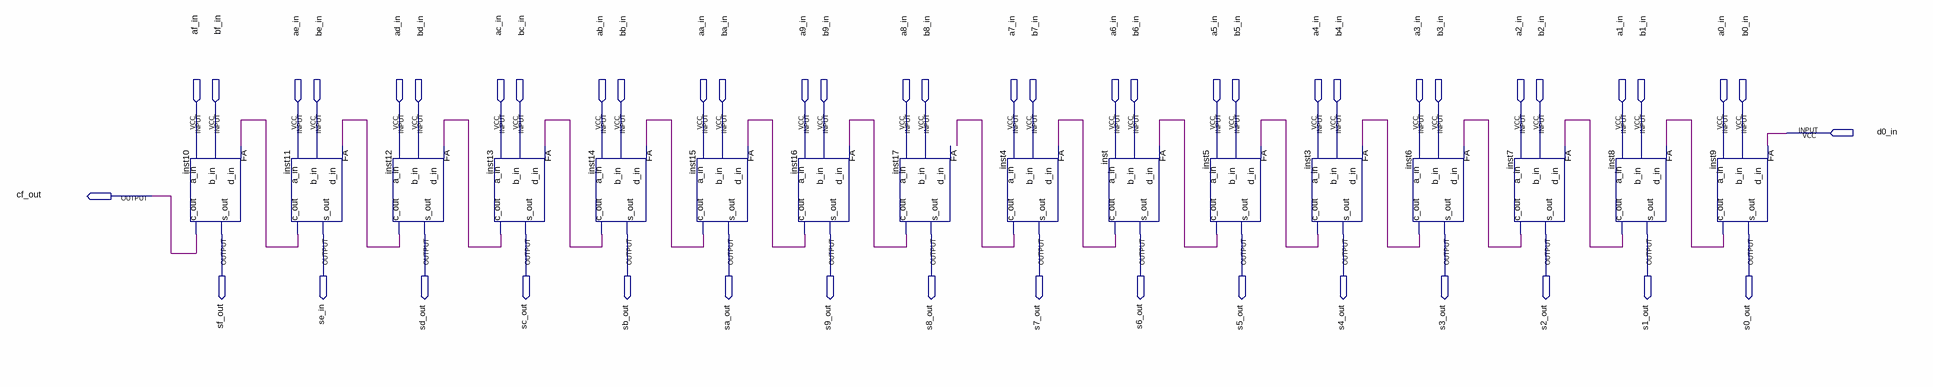
[diagram p0: schematic sheet]
// Quartus schematic sixteenBitFA.bdf as structural Verilog: 16 symbols, 50 pins
module sixteenBitFA (
  input  d0_in,
  input  af_in,
  input  bf_in,
  input  ae_in,
  input  be_in,
  input  ad_in,
  input  bd_in,
  input  ac_in,
  input  bc_in,
  input  ab_in,
  input  bb_in,
  input  aa_in,
  input  ba_in,
  input  a9_in,
  input  b9_in,
  input  a8_in,
  input  b8_in,
  input  a7_in,
  input  b7_in,
  input  a6_in,
  input  b6_in,
  input  a5_in,
  input  b5_in,
  input  a4_in,
  input  b4_in,
  input  a3_in,
  input  b3_in,
  input  a2_in,
  input  b2_in,
  input  a1_in,
  input  b1_in,
  input  a0_in,
  input  b0_in,
  output cf_out,
  output sf_out,
  output se_in,
  output sd_out,
  output sc_out,
  output sb_out,
  output sa_out,
  output s9_out,
  output s8_out,
  output s7_out,
  output s6_out,
  output s5_out,
  output s4_out,
  output s3_out,
  output s2_out,
  output s1_out,
  output s0_out
);

  wire inst3_c_out, inst4_c_out, inst5_c_out, inst6_c_out, inst7_c_out, inst8_c_out, inst9_c_out,
       inst11_c_out, inst12_c_out, inst13_c_out, inst14_c_out, inst15_c_out, inst16_c_out, inst17_c_out,
       inst_c_out;

  FA inst10 (.b_in(bf_in), .a_in(af_in), .d_in(inst11_c_out), .c_out(cf_out), .s_out(sf_out));
  FA inst11 (.b_in(be_in), .a_in(ae_in), .d_in(inst12_c_out), .c_out(inst11_c_out), .s_out(se_in));
  FA inst12 (.b_in(bd_in), .a_in(ad_in), .d_in(inst13_c_out), .c_out(inst12_c_out), .s_out(sd_out));
  FA inst13 (.b_in(bc_in), .a_in(ac_in), .d_in(inst14_c_out), .c_out(inst13_c_out), .s_out(sc_out));
  FA inst14 (.b_in(bb_in), .a_in(ab_in), .d_in(inst15_c_out), .c_out(inst14_c_out), .s_out(sb_out));
  FA inst15 (.b_in(ba_in), .a_in(aa_in), .d_in(inst16_c_out), .c_out(inst15_c_out), .s_out(sa_out));
  FA inst16 (.b_in(b9_in), .a_in(a9_in), .d_in(inst17_c_out), .c_out(inst16_c_out), .s_out(s9_out));
  FA inst17 (.b_in(b8_in), .a_in(a8_in), .c_out(inst17_c_out), .s_out(s8_out));  // open: d_in
  FA inst4 (.b_in(b7_in), .a_in(a7_in), .d_in(inst_c_out), .c_out(inst4_c_out), .s_out(s7_out));
  FA inst (.b_in(b6_in), .a_in(a6_in), .d_in(inst5_c_out), .c_out(inst_c_out), .s_out(s6_out));
  FA inst5 (.b_in(b5_in), .a_in(a5_in), .d_in(inst3_c_out), .c_out(inst5_c_out), .s_out(s5_out));
  FA inst3 (.b_in(b4_in), .a_in(a4_in), .d_in(inst6_c_out), .c_out(inst3_c_out), .s_out(s4_out));
  FA inst6 (.b_in(b3_in), .a_in(a3_in), .d_in(inst7_c_out), .c_out(inst6_c_out), .s_out(s3_out));
  FA inst7 (.b_in(b2_in), .a_in(a2_in), .d_in(inst8_c_out), .c_out(inst7_c_out), .s_out(s2_out));
  FA inst8 (.b_in(b1_in), .a_in(a1_in), .d_in(inst9_c_out), .c_out(inst8_c_out), .s_out(s1_out));
  FA inst9 (.b_in(b0_in), .a_in(a0_in), .d_in(d0_in), .c_out(inst9_c_out), .s_out(s0_out));
endmodule
